# Altium schematic sheet [04] - Display & Pi Zero & USB Host.SchDoc
size A3; DocumentNumber: 7; SheetNumber: 6; SheetTotal: 9
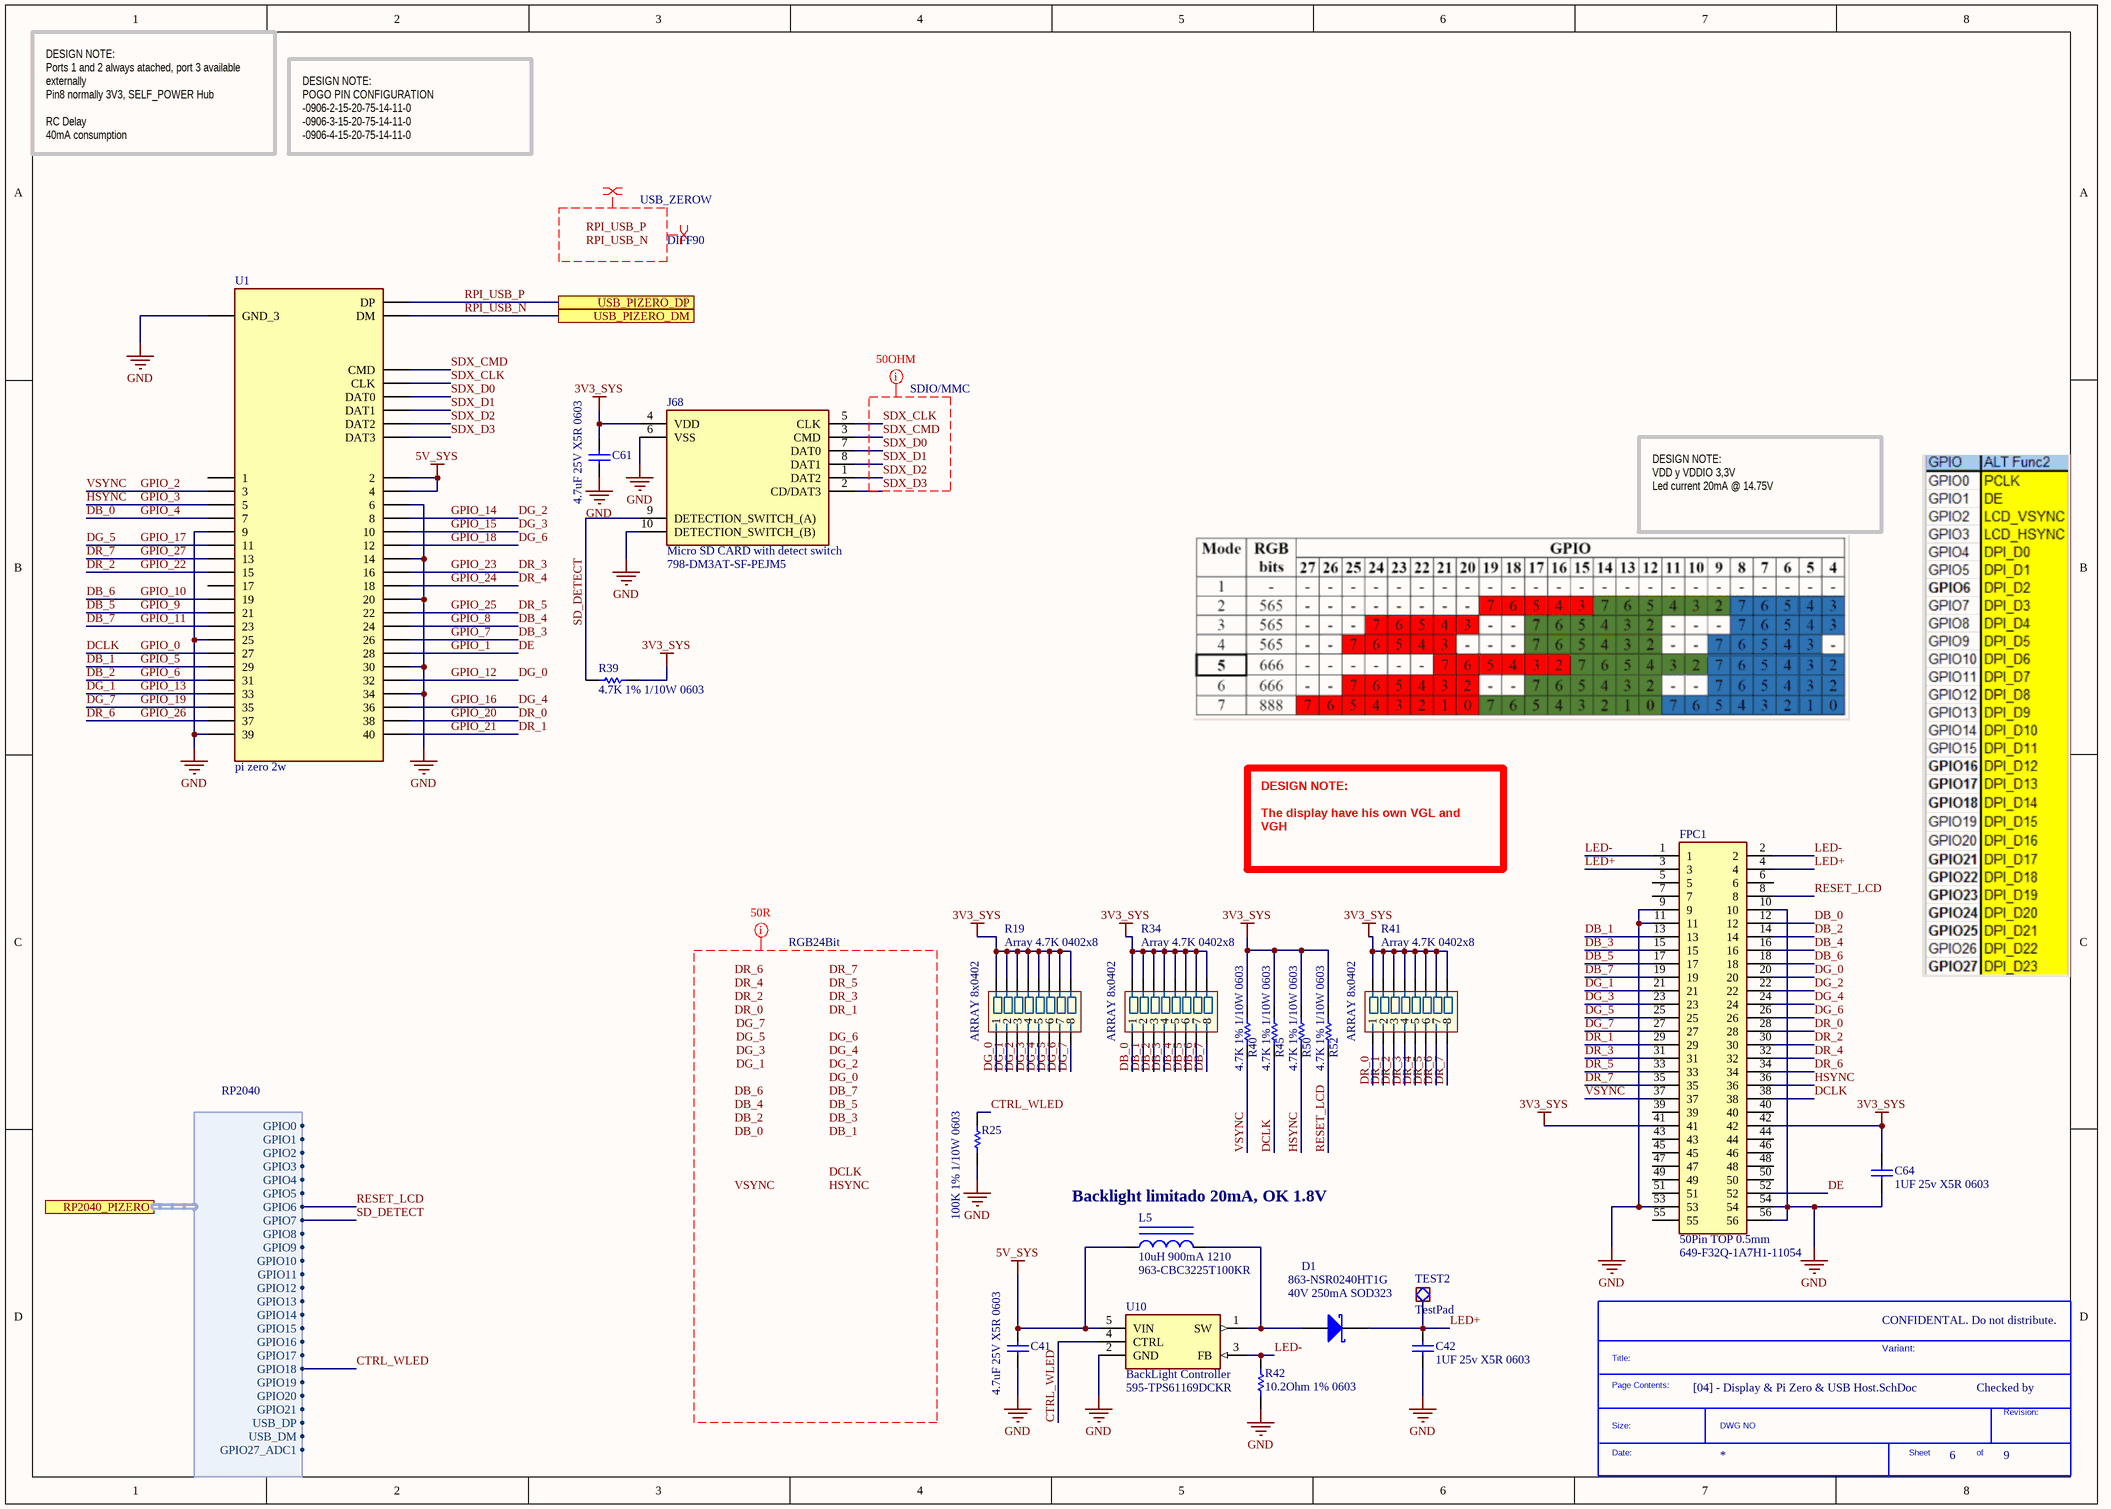
[diagram p0: [04] - Display & Pi Zero & USB Host.SchDoc]

## Parts
*  SDTitleBlock  (value not drawn)  (graphical)
C41  4.7uF 25V X5R 0603  [C 0603/1608]
C42  1UF 25v X5R 0603  [C 0603/1608]
C61  4.7uF 25V X5R 0603  [C 0603/1608]
C64  1UF 25v X5R 0603  [C 0603/1608]
D1  40V 250mA SOD323  Supplier Part Number 1: 863-NSR0240HT1G  [SOD-323]
FPC1  50Pin TOP 0.5mm  Supplier Part Number 1: 649-F32Q-1A7H1-11054  [XF2M54151AH]
J68  Micro SD CARD with detect switch  Supplier Part Number 1: 798-DM3AT-SF-PEJM5  [DM3AT-SF-PEJM5_1]
L5  10uH 900mA 1210  Supplier Part Number 1: 963-CBC3225T100KR  [L 1210/3225]
R19  Array 4.7K 0402x8  [YAG_YC248-M]
R25  100K 1% 1/10W 0603  [R 0603/1608]
R34  Array 4.7K 0402x8  [YAG_YC248-M]
R39  4.7K 1% 1/10W 0603  [R 0603/1608]
R40  4.7K 1% 1/10W 0603  [R 0603/1608]
R41  Array 4.7K 0402x8  [YAG_YC248-M]
R42  10.2Ohm 1% 0603  [R 0603/1608]
R45  4.7K 1% 1/10W 0603  [R 0603/1608]
R50  4.7K 1% 1/10W 0603  [R 0603/1608]
R52  4.7K 1% 1/10W 0603  [R 0603/1608]
TEST2  TestPad  [TestPad]  (no BOM)
U1  pi zero 2w  [Pi 2 Zero W - Release]
U10  BackLight Controller  Supplier Part Number 1: 595-TPS61169DCKR  [SOT65P210X110-5N]

## Ports
RP2040_PIZERO (harness RP2040), USB_PIZERO_DM, USB_PIZERO_DP

## Harnesses
RP2040: GPIO0, GPIO1, GPIO2, GPIO3, USB_DP, USB_DM, GPIO27_ADC1, GPIO4, GPIO5, GPIO6, GPIO7, GPIO8, GPIO9, GPIO10, GPIO11, GPIO12, GPIO13, GPIO14, GPIO15, GPIO16, GPIO17, GPIO18, GPIO19, GPIO20, GPIO21

## Nets
3V3_SYS: C61.1 C64.1 FPC1.41 FPC1.42 J68.4(VDD) R19.9 R19.10 R19.11 R19.12 R19.13 R19.14 R19.15 R19.16 R34.9 R34.10 R34.11 R34.12 R34.13 R34.14 R34.15 R34.16 R39.1 R40.2 R41.9 R41.10 R41.11 R41.12 R41.13 R41.14 R41.15 R41.16 R45.2 R50.2 R52.2
5V_SYS: C41.1 L5.1 U1.2 U1.4 U10.5(VIN)
GND: C41.2 C42.2 C61.2 C64.2 FPC1.9 FPC1.10 FPC1.11 FPC1.53 FPC1.54 FPC1.56 J68.6(VSS) J68.10(DETECTION_SWITCH_(B)) R25.1 R42.1 U1.6 U1.9 U1.14 U1.20 U1.25 U1.30 U1.34 U1.39 U1.GND_3 U10.2(GND)
CTRL_WLED: R25.2 U10.4(CTRL) ; port RP2040_PIZERO.GPIO18
DB_0: FPC1.12 R34.1 U1.7  [also labelled GPIO_4]
DB_1: FPC1.13 R34.2 U1.29  [also labelled GPIO_5]
DB_2: FPC1.14 R34.3 U1.31  [also labelled GPIO_6]
DB_3: FPC1.15 R34.4 U1.26  [also labelled GPIO_7]
DB_4: FPC1.16 R34.5 U1.24  [also labelled GPIO_8]
DB_5: FPC1.17 R34.6 U1.21  [also labelled GPIO_9]
DB_6: FPC1.18 R34.7 U1.19  [also labelled GPIO_10]
DB_7: FPC1.19 R34.8 U1.23  [also labelled GPIO_11]
DCLK: FPC1.38 R45.1 U1.27  [also labelled GPIO_0]
DE: FPC1.52 U1.28  [also labelled GPIO_1]
DG_0: FPC1.20 R19.1 U1.32  [also labelled GPIO_12]
DG_1: FPC1.21 R19.2 U1.33  [also labelled GPIO_13]
DG_2: FPC1.22 R19.3 U1.8  [also labelled GPIO_14]
DG_3: FPC1.23 R19.4 U1.10  [also labelled GPIO_15]
DG_4: FPC1.24 R19.5 U1.36  [also labelled GPIO_16]
DG_5: FPC1.25 R19.6 U1.11  [also labelled GPIO_17]
DG_6: FPC1.26 R19.7 U1.12  [also labelled GPIO_18]
DG_7: FPC1.27 R19.8 U1.35  [also labelled GPIO_19]
DR_0: FPC1.28 R41.1 U1.38  [also labelled GPIO_20]
DR_1: FPC1.29 R41.2 U1.40  [also labelled GPIO_21]
DR_2: FPC1.30 R41.3 U1.15  [also labelled GPIO_22]
DR_3: FPC1.31 R41.4 U1.16  [also labelled GPIO_23]
DR_4: FPC1.32 R41.5 U1.18  [also labelled GPIO_24]
DR_5: FPC1.33 R41.6 U1.22  [also labelled GPIO_25]
DR_6: FPC1.34 R41.7 U1.37  [also labelled GPIO_26]
DR_7: FPC1.35 R41.8 U1.13  [also labelled GPIO_27]
GPIO_2: FPC1.37 R40.1 U1.3  [also labelled VSYNC]
GPIO_3: FPC1.36 R50.1 U1.5  [also labelled HSYNC]
LED+: C42.1 D1.1(K) FPC1.3 FPC1.4 TEST2.1
LED-: FPC1.1 FPC1.2 R42.2 U10.3(FB)
RESET_LCD: FPC1.8 R52.1 ; port RP2040_PIZERO.GPIO6
RPI_USB_N: U1.DM ; port USB_PIZERO_DM
RPI_USB_P: U1.DP ; port USB_PIZERO_DP
SD_DETECT: J68.9(DETECTION_SWITCH_(A)) R39.2 ; port RP2040_PIZERO.GPIO7
SDX_CLK: J68.5(CLK) U1.CLK
SDX_CMD: J68.3(CMD) U1.CMD
SDX_D0: J68.7(DAT0) U1.DAT0
SDX_D1: J68.8(DAT1) U1.DAT1
SDX_D2: J68.1(DAT2) U1.DAT2
SDX_D3: J68.2(CD/DAT3) U1.DAT3
NetD1_2: D1.2(A) L5.2 U10.1(SW)

Not connected (* = marked no-connect by the designer): FPC1 5 6 7 39 40 43 44 45 46 47 48 49 50 51 55; U1 1 17

## Layout directives
net class USB_ZEROW; rule Differential Pairs Routing [Pref Gap = 0.18mm    Min Gap  = 0.18mm    Max Gap  = 0.18mmPref Width = 0.15mm    Min Width  = 0.15mm    Max Width  = 0.15mm]: RPI_USB_N, RPI_USB_P
differential pair; net class DIFF90: RPI_USB_N, RPI_USB_P
net class RGB24Bit; rule Width Constraint [Pref Width = 0.18mm    Min Width = 0.18mm    Max Width = 0.18mm]: DB_0, DB_1, DB_2, DB_3, DB_4, DB_5, DB_6, DB_7, DCLK, DG_0, DG_1, DG_2, DG_3, DG_4, DG_5, DG_6, DG_7, DR_0, DR_1, DR_2, DR_3, DR_4, DR_5, DR_6, DR_7, HSYNC, VSYNC
net class SDIO/MMC; rule Width Constraint [Pref Width = 0.18mm    Min Width = 0.18mm    Max Width = 0.18mm]: SDX_CLK, SDX_CMD, SDX_D0, SDX_D1, SDX_D2, SDX_D3

## Notes on the sheet
- DESIGN NOTE:
  Ports 1 and 2 always atached, port 3 available externally
  Pin8 normally 3V3, SELF_POWER Hub
  RC Delay
  40mA consumption
- DESIGN NOTE:
  POGO PIN CONFIGURATION
  -0906-2-15-20-75-14-11-0
  -0906-3-15-20-75-14-11-0
  -0906-4-15-20-75-14-11-0
- DESIGN NOTE:
  VDD y VDDIO 3,3V
  Led current 20mA @ 14.75V
- DESIGN NOTE:
  The display have his own VGL and VGH
- (near L5) Backlight limitado 20mA, OK 1.8V
- CONFIDENTAL. Do not distribute.
- Variant:
- Checked by
- Labels drawn without touching a wire or pin: DB_0, DB_1, DB_2, DB_3, DB_4, DB_5, DB_6, DB_7, DCLK, DG_0, DG_1, DG_2, DG_3, DG_4, DG_5, DG_6, DG_7, DR_0, DR_1, DR_2, DR_3, DR_4, DR_5, DR_6, DR_7, HSYNC, RPI_USB_N, RPI_USB_P, VSYNC
- (in symbol SDTitleBlock) Title:; Page Contents:; Revision:; Size:; DWG NO; Date:; Sheet; of
- (in symbol YC248-JR-074K7L) ARRAY 8x0402

## Library data of the parts
C41 C61 = TMK107BBJ475MA-T: Condensadores de cerámica multicapa (MLCC- SMD/SMT) 0603 25VDC 4.7uF 20% X5R; Manufacturer 1: Taiyo Yuden; Supplier 1: Mouser; Manufacturer Part Number 1: TMK107BBJ475MA-T; Stock 1: 7442; Pricing 1: 1=0.31000, 10=0.15200, 50=0.15200, 100=0.10900, 1000=0.08300, 10000=0.06500 (USD); RoHS: No; Supplier Part Number 1: 963-TMK107BBJ475MA-T
C42 C64 = CC0603KRX5R8BB105: CAP CER 1UF 25V X5R 0603; Manufacturer: Yageo; Tolerance: 10%; Supplier 1: Mouser; Manufacturer Part Number: CC0603KRX5R8BB105; RoHS: Yes; Stock 1: 9567246; Pricing 1: 1 = 0,10000, 10 = 0,04700, 50 = 0,04700, 100 = 0,01700, 1000 = 0,01600, 10000 = 0,00800 (USD); Mount: Surface Mount; Case/Package: 0603; Number of Pins: 2; Case Code (Metric): 1608; Case Code (Imperial): 0603; Min Operating Temperature: -55°C; Max Operating Temperature: 85°C; Package Quantity: 1; Capacitance: 1uF; Voltage Rating: 25V; Packaging: Tape and Reel; Dielectric: X5R; Termination: SMD/SMT; Voltage Rating (DC): 25V; Length: 1.6mm; Height: 0.8mm; Width: 0.031inch; Thickness: 0.035inch; Depth: 0.8mm; Radiation Hardening: No; REACH SVHC: No SVHC; Lead Free: Lead Free; Halogen Free: Halogen Free; ComponentLink1URL: https://datasheet.ciiva.com/176/mlccorderingcode-176785.pdf?src-supplier=Digi-Key; ComponentLink1Description: https://datasheet.ciiva.com/176/mlccorderingcode-176785.pdf?src-supplier=Digi-Key; ComponentLink2URL: https://datasheet.ciiva.com/176/mlccorderingcode-176786.pdf?src-supplier=Digi-Key; ComponentLink2Description: https://datasheet.ciiva.com/176/mlccorderingcode-176786.pdf?src-supplier=Digi-Key; ComponentLink3URL: https://datasheet.ciiva.com/176/mlccorderingcode-176787.pdf?src-supplier=Digi-Key; ComponentLink3Description: https://datasheet.ciiva.com/176/mlccorderingcode-176787.pdf?src-supplier=Digi-Key; ComponentLink4URL: https://datasheet.ciiva.com/17436/upy-gphc-x5r-4v-to-50v-12-17436952.pdf?src-supplier=Avnet+Europe; ComponentLink4Description: https://datasheet.ciiva.com/17436/upy-gphc-x5r-4v-to-50v-12-17436952.pdf?src-supplier=Avnet+Europe; ComponentLink5URL: https://datasheet.ciiva.com/7978/1525783-7978171.pdf?src-supplier=Element14; ComponentLink5Description: https://datasheet.ciiva.com/7978/1525783-7978171.pdf?src-supplier=Element14; ComponentLink6URL: https://datasheet.ciiva.com/11586/upy-gphc-x5r-4v-to-50v-12-11586318.pdf?src-supplier=Avnet; ComponentLink6Description: https://datasheet.ciiva.com/11586/upy-gphc-x5r-4v-to-50v-12-11586318.pdf?src-supplier=Avnet; Supplier Part Number 1: 603-CC603KRX5R8BB105
D1 = NSR0240HT1G: DIODE SCHOTTKY 40V 250MA SOD323; Manufacturer: ON Semiconductor; Max Surge Current: 1A; Recovery Time: 3ns; Peak Reverse Current: 10uA; Forward Voltage: 710mV; Power Dissipation: 270mW; Element Configuration: Single; Supplier 1: Mouser; Manufacturer Part Number: NSR0240HT1G; RoHS: Yes; Stock 1: 30582; Pricing 1: 1 = 0,23000, 10 = 0,15400, 50 = 0,15400, 100 = 0,06500, 1000 = 0,04400, 10000 = 0,03000 (USD); Case/Package: SOD-323-2; Number of Pins: 2; Contact Plating: Tin; Min Operating Temperature: -55°C; Max Operating Temperature: 150°C; Package Quantity: 1; Forward Current: 250mA; Packaging: Tape and Reel; Max Reverse Leakage Current: 10uA; Average Rectified Current: 250mA; Reverse Recovery Time: 3ns; Max Repetitive Reverse Voltage (Vrrm): 40V; Peak Non-Repetitive Surge Current: 1A; Max Forward Surge Current (Ifsm): 1A; Max Reverse Voltage (DC): 40V; Length: 1.8mm; Height: 1mm; Width: 1.35mm; Radiation Hardening: No; REACH SVHC: No SVHC; Lead Free: Lead Free; ComponentLink1URL: https://datasheet.ciiva.com/4714/nsr0240h-d-113658-4714368.pdf?src-supplier=Mouser; ComponentLink1Description: https://datasheet.ciiva.com/4714/nsr0240h-d-113658-4714368.pdf?src-supplier=Mouser; ComponentLink2URL: https://datasheet.ciiva.com/8293/nsr0240h-d-8293840.pdf?src-supplier=Avnet; ComponentLink2Description: https://datasheet.ciiva.com/8293/nsr0240h-d-8293840.pdf?src-supplier=Avnet; ComponentLink3URL: https://datasheet.ciiva.com/25949/nsr0240h-d-25949637.pdf?src-supplier=Avnet+Europe; ComponentLink3Description: https://datasheet.ciiva.com/25949/nsr0240h-d-25949637.pdf?src-supplier=Avnet+Europe; ComponentLink4URL: https://datasheet.ciiva.com/915/nsr0240h-d-915416.pdf?src-supplier=Digi-Key; ComponentLink4Description: https://datasheet.ciiva.com/915/nsr0240h-d-915416.pdf?src-supplier=Digi-Key; ComponentLink5URL: https://datasheet.ciiva.com/915/nsr0240h-d-915417.pdf?src-supplier=Digi-Key; ComponentLink5Description: https://datasheet.ciiva.com/915/nsr0240h-d-915417.pdf?src-supplier=Digi-Key; ComponentLink6URL: https://datasheet.ciiva.com/16396/nsr0240h-d-16396521.pdf?src-supplier=Future+Electronics; ComponentLink6Description: https://datasheet.ciiva.com/16396/nsr0240h-d-16396521.pdf?src-supplier=Future+Electronics; ComponentLink7URL: https://datasheet.ciiva.com/915/nsr0240h-d-915418.pdf?src-supplier=Digi-Key; ComponentLink7Description: https://datasheet.ciiva.com/915/nsr0240h-d-915418.pdf?src-supplier=Digi-Key; ComponentLink8URL: https://datasheet.ciiva.com/7963/nsr0240h-d-7963165.pdf?src-supplier=Element14; ComponentLink8Description: https://datasheet.ciiva.com/7963/nsr0240h-d-7963165.pdf?src-supplier=Element14
FPC1 = F32Q-1A7H1-11054: FPC/FFC Connector Socket 54 Position 0.5mm Top Contact Solder Right Angle Surface Mount T/R; Manufacturer: Amphenol ICC / FCI; Supplier 1: Mouser; Manufacturer Part Number: F32Q-1A7H1-11054; RoHS: No; Category: FFC / FPC; Stock 1: 5116; Pricing 1: 1=1,34, 10=1,06, 50=1,06, 100=0,919, 1000=0,627, 10000=0,597 (USD)
J68 = DM3AT-SF-PEJM5: CONN MICRO SD CARD PUSH-PUSH R/A; Manufacturer 1: Hirose; Connector Type: Connector; Number of Contacts: 8; Current Rating: 500mA; Voltage Rating: 125V; Gender: Female; Pitch: 1.1mm; Supplier 1: Mouser; Manufacturer Part Number 1: DM3AT-SF-PEJM5; RoHS: Yes; Category: Card Edge Connectors; Stock 1: 5089; Pricing 1: 1=2,61000, 10=2,32000, 25=2,13000, 100=2,03000, 250=1,84000, 500=1,69000 (USD); Mount: Surface Mount,Standard; Contact Plating: Gold; Contact Material: Copper Alloy; Housing Material: Polymer; Min Operating Temperature: -25°C; Max Operating Temperature: 85°C; Packaging: Tape and Reel; Number of Rows: 1; Package Quantity: 1; Orientation: Right Angle; Termination: SMD/SMT; Max Current Rating: 500mA; Max Voltage Rating (AC): 125V; Number of Positions: 8; Length: 15.95mm; Height: 1.68mm; Width: 13.85mm; Depth: 15.95mm; Radiation Hardening: No; Flammability Rating: UL94 V-0; REACH SVHC: No SVHC; Lead Free: Lead Free; ComponentLink1URL: https://datasheet.ciiva.com/683/e60900232-683393.pdf?src-supplier=Digi-Key; ComponentLink1Description: https://datasheet.ciiva.com/683/e60900232-683393.pdf?src-supplier=Digi-Key; ComponentLink2URL: https://datasheet.ciiva.com/683/e60900232-683394.pdf?src-supplier=Digi-Key; ComponentLink2Description: https://datasheet.ciiva.com/683/e60900232-683394.pdf?src-supplier=Digi-Key; ComponentLink3URL: https://datasheet.ciiva.com/683/e60900232-683395.pdf?src-supplier=Digi-Key; ComponentLink3Description: https://datasheet.ciiva.com/683/e60900232-683395.pdf?src-supplier=Digi-Key; ComponentLink4URL: https://datasheet.ciiva.com/46418/1697167-46418261.pdf?src-supplier=Element14; ComponentLink4Description: https://datasheet.ciiva.com/46418/1697167-46418261.pdf?src-supplier=Element14; ComponentLink5URL: https://datasheet.ciiva.com/3122/e60900232-3122534.pdf?src-supplier=Avnet; ComponentLink5Description: https://datasheet.ciiva.com/3122/e60900232-3122534.pdf?src-supplier=Avnet; ComponentLink6URL: https://datasheet.ciiva.com/46418/1697167-46418262.pdf?src-supplier=Element14; ComponentLink6Description: https://datasheet.ciiva.com/46418/1697167-46418262.pdf?src-supplier=Element14; ComponentLink7URL: https://datasheet.ciiva.com/16205/e60900232-16205727.pdf?src-supplier=Future+Electronics; ComponentLink7Description: https://datasheet.ciiva.com/16205/e60900232-16205727.pdf?src-supplier=Future+Electronics
L5 = CBC3225T100KR: Fixed Inductors 1210 10uH 172.9mOhms +/-10% 900mA HiCur; Manufacturer: Taiyo Yuden; Core Material: Ferrite; Self Resonant Frequency: 23MHz; Tolerance: 10%; DC Resistance (DCR): 133mR; Shielding: Unshielded; Test Frequency: 100kHz; Supplier 1: Mouser; Manufacturer Part Number: CBC3225T100KR; RoHS: Yes; Stock 1: 98328; Pricing 1: 1 = 0,25000, 10 = 0,22100, 50 = 0,22100, 100 = 0,15200, 1000 = 0,10200, 10000 = 0,07700 (USD); Mount: Surface Mount; Case/Package: 1210; Case Code (Metric): 3225; Case Code (Imperial): 1210; Min Operating Temperature: -40°C; Max Operating Temperature: 105°C; Inductance: 10uH; Packaging: Tape and Reel; Max DC Current: 900mA; Package Quantity: 1000; Current Rating: 900mA; Saturation Current: 900mA; Termination: SMD/SMT; Composition: Wirewound; Inductance Tolerance: 10%; DC Current: 900mA; Military Standard: Not; Length: 0.126inch; Height: 2.5mm; Width: 2.5mm; Height - Seated (Max): 0.106inch; Depth: 2.7mm; Radiation Hardening: No; Lead Free: Lead Free; REACH SVHC: Unknown; Halogen Free: Halogen Free; ComponentLink1URL: https://datasheet.ciiva.com/26871/getdatasheetpartid-637483-26871170.pdf?src-supplier=Verical; ComponentLink1Description: https://datasheet.ciiva.com/26871/getdatasheetpartid-637483-26871170.pdf?src-supplier=Verical; ComponentLink2URL: https://datasheet.ciiva.com/6701/cbc3225t100kr-ss-6701092.pdf?src-supplier=Digi-Key; ComponentLink2Description: https://datasheet.ciiva.com/6701/cbc3225t100kr-ss-6701092.pdf?src-supplier=Digi-Key
R19 R34 R41 = YC248-JR-074K7L: RES ARRAY 8 RES 4.7K OHM 1606; Manufacturer 1: Yageo; Resistance: 4.7kR; Number of Resistors: 8; Temperature Coefficient: 200ppm/°C; Tolerance: 5%; Voltage Rating: 50V; Circuit Type: Isolated; Power Per Element: 62.5mW; Number of Contacts: 16; Supplier 1: Mouser; Manufacturer Part Number 1: YC248-JR-074K7L; Stock 1: 7603; Pricing 1: 1=0,31000, 10=0,19200, 100=0,06500, 1000=0,04400, 5000=0,03300, 10000=0,03100, 25000=0,02900, 50000=0,02800 (USD); RoHS: Yes; Mount: Surface Mount; Case/Package: 0616; Number of Pins: 16; Number of Terminals: 16; Case Code (Metric): 1640; Case Code (Imperial): 0616; Min Operating Temperature: -55°C; Max Operating Temperature: 155°C; Number of Elements: 8; Package Quantity: 1; Packaging: Tape and Reel; Military Standard: Not; Termination: Convex; Number of Circuits: 8; Length: 0.157inch; Height: 0.022inch; Width: 0.063inch; Terminal Pitch: 0.5mm; Depth: 1.6mm; Radiation Hardening: No; REACH SVHC: Unknown; Lead Free: Lead Free; ComponentLink1URL: https://datasheet.ciiva.com/8311/pyu-yc248-51-rohs-l-2-8311734.pdf?src-supplier=Avnet; ComponentLink1Description: https://datasheet.ciiva.com/8311/pyu-yc248-51-rohs-l-2-8311734.pdf?src-supplier=Avnet; ComponentLink2URL: https://datasheet.ciiva.com/28380/pyu-yc248-51-rohs-l-2-28380408.pdf?src-supplier=Avnet+Europe; ComponentLink2Description: https://datasheet.ciiva.com/28380/pyu-yc248-51-rohs-l-2-28380408.pdf?src-supplier=Avnet+Europe; ComponentLink3URL: https://datasheet.ciiva.com/2689/pyu-r-marking-2-2689433.pdf?src-supplier=Digi-Key; ComponentLink3Description: https://datasheet.ciiva.com/2689/pyu-r-marking-2-2689433.pdf?src-supplier=Digi-Key; ComponentLink4URL: https://datasheet.ciiva.com/2689/pyu-r-marking-2-2689434.pdf?src-supplier=Digi-Key; ComponentLink4Description: https://datasheet.ciiva.com/2689/pyu-r-marking-2-2689434.pdf?src-supplier=Digi-Key; ComponentLink5URL: https://datasheet.ciiva.com/2689/pyu-r-marking-2-2689435.pdf?src-supplier=Digi-Key; ComponentLink5Description: https://datasheet.ciiva.com/2689/pyu-r-marking-2-2689435.pdf?src-supplier=Digi-Key; ComponentLink6URL: https://datasheet.ciiva.com/8018/443139-8018062.pdf?src-supplier=Element14; ComponentLink6Description: https://datasheet.ciiva.com/8018/443139-8018062.pdf?src-supplier=Element14; ComponentLink7URL: https://datasheet.ciiva.com/8018/443139-8018063.pdf?src-supplier=Element14; ComponentLink7Description: https://datasheet.ciiva.com/8018/443139-8018063.pdf?src-supplier=Element14; Supplier Part Number 1: 603-YC248-JR-074K7L
R25 = RC0603FR-07100KL: RES SMD 100K OHM 1% 1/10W 0603; Manufacturer: Yageo; Power (Watts): 0.1W, 1/10W; Temperature Coefficient: ±100ppm/°C; Supplier 1: Digi-Key; Manufacturer Part Number: RC0603FR-07100KL; RoHS: RoHS Compliant; Category: Resistors; Stock 1: 6298016; Pricing 1: 1=0.08, 10=0.013, 100=0.005, 1000=0.00224, 2500=0.00195 (EUR); Packaging: Cut Tape (CT); Part Status: Active; Tolerance: ±1%; Composition: Thick Film; Features: Moisture Resistant; Operating Temperature: -55°C ~ 155°C; Package / Case: 0603 (1608 Metric); Supplier Device Package: 0603; Size / Dimension: 0.063" L x 0.032" W (1.60mm x 0.80mm); Height - Seated (Max): 0.022" (0.55mm); Failure Rate: -; ComponentLink1URL: http://www.yageo.com/documents/recent/PYu-RC_Group_51_RoHS_L_8.pdf; ComponentLink1Description: http://www.yageo.com/documents/recent/PYu-RC_Group_51_RoHS_L_8.pdf; Supplier Part Number 1: 311-100KHRCT-ND
R39 R40 R45 R50 R52 = RC0603FR-074K7L: RES SMD 4.7K OHM 1% 1/10W 0603; Manufacturer: Yageo; Resistance: 4.7kR; Temperature Coefficient: 100ppm/°C; Power Rating: 100mW; Voltage Rating (DC): 50V; Supplier 1: Mouser; Manufacturer Part Number: RC0603FR-074K7L; RoHS: Yes; Stock 1: 3735049; Pricing 1: 1 = 0,10000, 10 = 0,01800, 50 = 0,01800, 100 = 0,00600, 1000 = 0,00500, 10000 = 0,00300 (USD); Case/Package: 0603; Number of Pins: 2; Case Code (Imperial): 0603; Case Code (Metric): 1608; Min Operating Temperature: -55°C; Max Operating Temperature: 155°C; Tolerance: 1%; Composition: Thick Film; Packaging: Tape and Reel; Voltage Rating: 50V; Termination: SMD/SMT; Military Standard: Not; Length: 1.6mm; Height: 0.45mm; Width: 0.8mm; Depth: 0.8mm; Lead Pitch: 0.3mm; REACH SVHC: No SVHC; Lead Free: Lead Free; ComponentLink1URL: https://datasheet.ciiva.com/15189/getdatasheetpartid-422754-15189760.pdf?src-supplier=Verical; ComponentLink1Description: https://datasheet.ciiva.com/15189/getdatasheetpartid-422754-15189760.pdf?src-supplier=Verical; ComponentLink2URL: https://datasheet.ciiva.com/22747/443971-22747528.pdf?src-supplier=Element14; ComponentLink2Description: https://datasheet.ciiva.com/22747/443971-22747528.pdf?src-supplier=Element14; ComponentLink3URL: https://datasheet.ciiva.com/7660/38590-7660794.pdf?src-supplier=Element14; ComponentLink3Description: https://datasheet.ciiva.com/7660/38590-7660794.pdf?src-supplier=Element14; ComponentLink4URL: https://datasheet.ciiva.com/7746/1868787-7746365.pdf?src-supplier=Element14; ComponentLink4Description: https://datasheet.ciiva.com/7746/1868787-7746365.pdf?src-supplier=Element14; ComponentLink5URL: https://datasheet.ciiva.com/46440/1868787-46440909.pdf?src-supplier=Element14; ComponentLink5Description: https://datasheet.ciiva.com/46440/1868787-46440909.pdf?src-supplier=Element14; ComponentLink6URL: https://datasheet.ciiva.com/7746/1738695-7746366.pdf?src-supplier=Element14; ComponentLink6Description: https://datasheet.ciiva.com/7746/1738695-7746366.pdf?src-supplier=Element14; Supplier Part Number 1: 603-RC0603FR-074K7L
R42 = RC0603FR-0710R2L: RES SMD 10.2 OHM 1% 1/10W 0603; Manufacturer 1: Yageo; Resistance: 10.2R; Temperature Coefficient: 100ppm/°C; Power Rating: 100mW; Voltage Rating: 50V; Supplier 1: Mouser; Manufacturer Part Number 1: RC0603FR-0710R2L; Stock 1: 27905; Pricing 1: 1=0.10000, 10=0.01800, 50=0.01800, 100=0.00600, 1000=0.00500, 5000=0.00300, 10000=0.00300, 50000=0.00200 (USD); RoHS: Yes; Case/Package: 0603; Contact Plating: Tin; Case Code (Imperial): 0603; Case Code (Metric): 1608; Min Operating Temperature: -55°C; Max Operating Temperature: 155°C; Tolerance: 1%; Composition: Thick Film; Packaging: Tape and Reel; Termination: SMD/SMT; Military Standard: Not; Voltage Rating (DC): 50V; Length: 1.6mm; Height: 0.45mm; Width: 0.8mm; Depth: 0.8mm; Radiation Hardening: No; Lead Free: Lead Free; ComponentLink1URL: https://datasheet.ciiva.com/12575/rc0603-272842-12575110.pdf?src-supplier=Mouser; ComponentLink1Description: https://datasheet.ciiva.com/12575/rc0603-272842-12575110.pdf?src-supplier=Mouser; Supplier Part Number 1: 603-RC0603FR-0710R2L
TEST2 = PP_SMT_ROUND_2MM: Probe Pad, SMT, ROUND, 2.0MM
U1 = PI ZERO 2W: Comprar los pogo 575-906015  x 60 y los de los tornillos x4 710-9774025151R
U10 = TPS61169DCKR: IC LED DRVR RGLTR DIM 1.8A SC70; Manufacturer: Texas Instruments; Max Input Voltage: 5.5V; Number of Outputs: 1; Output Current: 400mA; Min Input Voltage: 2.7V; Max Output Current: 2.4A; Switching Frequency: 1.2MHz; Max Output Voltage: 38V; Nominal Input Voltage (DC): 3.6V; Topology: Boost; Dimming: PWM; Output Type: Frequency; Supplier 1: Mouser; Manufacturer Part Number: TPS61169DCKR; RoHS: Yes; Stock 1: 91313; Pricing 1: 1 = 0,90000, 10 = 0,77000, 50 = 0,77000, 100 = 0,58700, 1000 = 0,41000, 10000 = 0,35000 (USD); Mount: Surface Mount; Case/Package: SC; Number of Pins: 5; Weight: 0.000705oz; Contact Plating: Gold; Min Operating Temperature: -40°C; Max Operating Temperature: 85°C; Output Current per Channel: 1.8A; Package Quantity: 3000; Number of Channels: 1; Packaging: Tape and Reel; Max Supply Voltage: 5.5V; Frequency: 1.2MHz; Min Output Voltage: 2.7V; Output Voltage: 38V; Max Input Voltage (DC): 5.5V; Length: 2mm; Height: 1.1mm; Width: 1.25mm; REACH SVHC: No SVHC; Lead Free: Lead Free; ComponentLink1URL: http://www.ti.com/general/docs/lit/getliterature.tsp?genericPartNumber=TPS61169&&fileType=pdf&src-supplier=Element14; ComponentLink1Description: http://www.ti.com/general/docs/lit/getliterature.tsp?genericPartNumber=TPS61169&&fileType=pdf&src-supplier=Element14; ComponentLink2URL: http://www.ti.com/general/docs/lit/getliterature.tsp?genericPartNumber=TPS61169&amp;&amp;fileType=pdf&src-supplier=Farnell; ComponentLink2Description: http://www.ti.com/general/docs/lit/getliterature.tsp?genericPartNumber=TPS61169&amp;&amp;fileType=pdf&src-supplier=Farnell; ComponentLink3URL: http://www.ti.com/general/docs/lit/getliterature.tsp?genericPartNumber=TPS61169&&fileType=pdf&src-supplier=Avnet; ComponentLink3Description: http://www.ti.com/general/docs/lit/getliterature.tsp?genericPartNumber=TPS61169&&fileType=pdf&src-supplier=Avnet; ComponentLink4URL: http://www.ti.com/lit/ds/symlink/tps61169.pdf?src-supplier=Digi-Key; ComponentLink4Description: http://www.ti.com/lit/ds/symlink/tps61169.pdf?src-supplier=Digi-Key; ComponentLink5URL: http://www.ti.com/lit/gpn/tps61169?src-supplier=Mouser; ComponentLink5Description: http://www.ti.com/lit/gpn/tps61169?src-supplier=Mouser; ComponentLink6URL: http://www.ti.com/general/docs/lit/getliterature.tsp?genericPartNumber=TPS61169&&fileType=pdf&src-supplier=Avnet+Asia; ComponentLink6Description: http://www.ti.com/general/docs/lit/getliterature.tsp?genericPartNumber=TPS61169&&fileType=pdf&src-supplier=Avnet+Asia